# EAGLE design buzzer_single_layer (EAGLE 9.5.1)
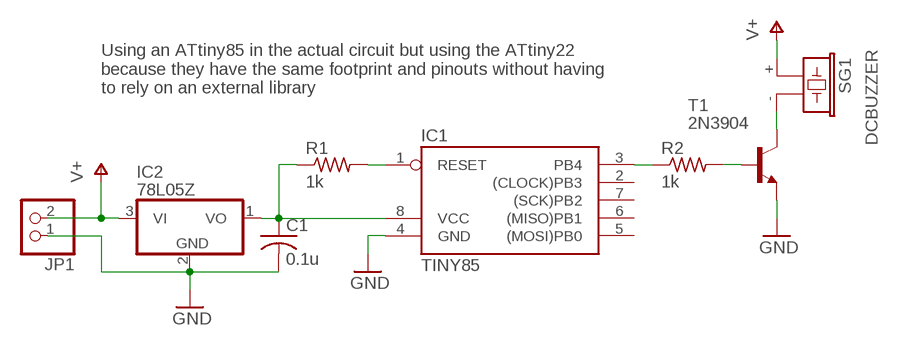
[diagram p0: schematic, sheet 1]

## Parts
C1  0.1u  C-US025-050X050  [C025-050X050]
IC1  TINY85  TINY22P  [DIL08]
IC2  78L05Z  [TO92]
JP1  PINHD-1X2  [1X02]
R1  1k  R-US_0204/7  [0204/7]
R2  1k  R-US_0204/7  [0204/7]
SG1  DCBUZZER  F/CM12P  [F/CM12P]
T1  2N3904  [TO92]

## Nets
5V: C1.1 IC1.8(VCC) IC2.1(VO) R1.1
BUZ_NEG: SG1.- T1.1(C)
GND: C1.2 IC1.4(GND) IC2.2(GND) JP1.1 T1.3(E)
N$1: R2.2 T1.2(B)
N$2: IC1.3(PB4) R2.1
RESET: IC1.1(RESET) R1.2
V+: IC2.3(VI) JP1.2 SG1.+
Unconnected: IC1.2((CLOCK)PB3) IC1.5((MOSI)PB0) IC1.6((MISO)PB1) IC1.7((SCK)PB2)

## Notes on the sheet
- Using an ATtiny85 in the actual circuit but using the ATtiny22 
  because they have the same footprint and pinouts without having
  to rely on an external library

## Library data of the parts
C1 = rcl:C-US: CAPACITOR, American symbol; SPICEPREFIX: C
IC1 = atmel:TINY22: MICROCONTROLLER 1K ROM 128 bytes RAM 128 bytes EEPROM; OC_FARNELL: unknown; OC_NEWARK: unknown
IC2 = linear:78*: Positive VOLTAGE REGULATOR Source: http://cache.national.com/ds/LM/LM78L05.pdf http://www.fairchildsemi.com/ds/LM/LM7805.pdf
JP1 = pinhead:PINHD-1X2: PIN HEADER
R1 R2 = rcl:R-US_: RESISTOR, American symbol; SPICEPREFIX: R
SG1 = buzzer:F/CM12P: BUZZER Source: Buerklin; OC_FARNELL: unknown; OC_NEWARK: unknown
T1 = transistor:2N3904: NPN TRANSISTOR

## Net classes
0 default: width 0.305 mm, drill 0.762 mm, clearance 0.61 mm

## Board
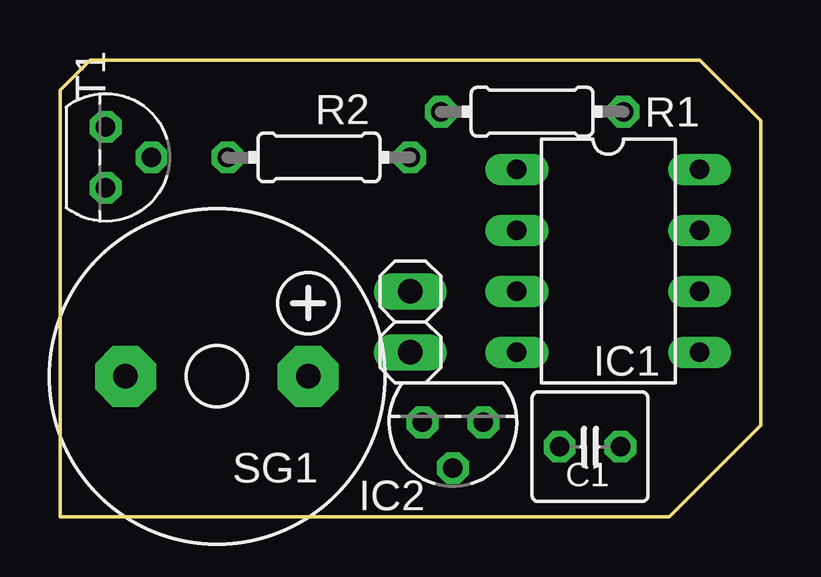
[diagram p1: board, top side]
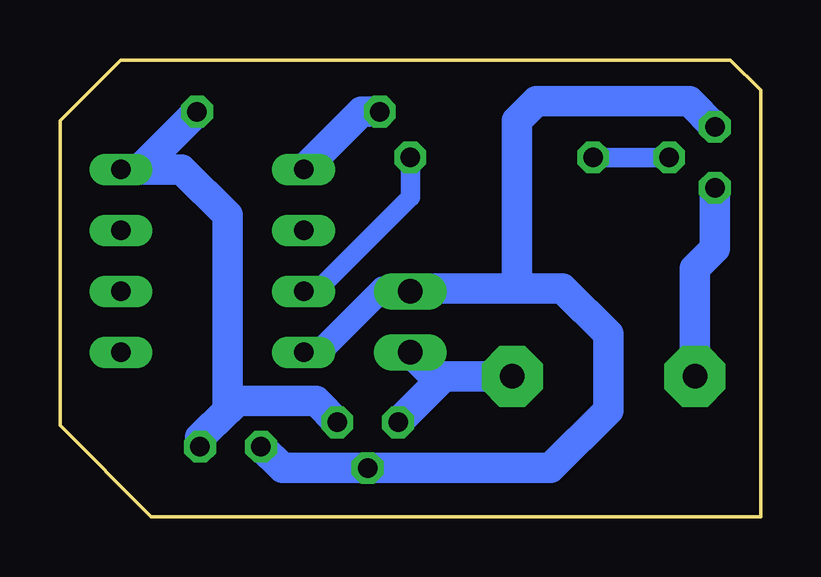
[diagram p2: board, bottom side, seen from below]

Size 29.21 x 19.05 mm. Coordinates in mm from the lower left corner, seen from the top.
Outline: 0,0 25.4,0 29.21,3.81 29.21,16.51 26.67,19.05 1.27,19.05 0,17.78 0,0
Copper layers (1*16): Top 0.035mm / dielectric 1.5mm / Bottom 0.035mm
Design rules "default": minimum track width 6mil, minimum drill 0.35mm, track to track 6mil, track to pad 6mil, pad to pad 6mil, via to via 6mil, smd to smd 6mil, copper to edge 40mil, drill to drill 6mil, minimum pad ring 10mil, minimum via ring 8mil, stop-mask expansion 4mil, vias tented up to drill 0mil, thermal gap 10mil

### Footprints (pad centres in the part's own frame; a part is rotated, then mirrored left to right if it is on the bottom)
C025-050X050 = drill 0.813 octagon: 1 -1.27,0; 2 1.27,0
DIL08 = drill 0.813 long: 1 -3.81,-3.81; 2 -1.27,-3.81; 3 1.27,-3.81; 4 3.81,-3.81; 5 3.81,3.81; 6 1.27,3.81; 7 -1.27,3.81; 8 -3.81,3.81
TO92 = drill 0.813 octagon: 1 -1.27,0; 2 0,1.905; 3 1.27,0
1X02 = drill 1.016 long: 1 -1.27,0; 2 1.27,0
0204/7 = drill 0.813 octagon: 1 -3.81,0; 2 3.81,0
F/CM12P = drill 1.016 pad 2.54 octagon: + 3.81,0; - -3.81,0
TO92' = drill 0.813 octagon: 1 1.27,0; 2 0,1.905; 3 -1.27,0

### Placement (x,y rotation side)
C1  22.1,2.92 180 top
IC1  22.86,10.67 270 top
IC2  16.38,3.94 180 top
JP1  14.61,8.13 270 top
R1  19.68,16.89 180 top
R2  10.79,14.99 180 top
SG1  6.54,5.86 0 top
T1  2N3904  [TO92']  1.91,14.99 270 top

### Tracks (layer width: path | path; a pad name or v marks a point on that pad's centre or on a via)
5V
  Bottom 1.27: R1.1 25.91,14.48 IC1.8 24.13,14.48 22.23,12.57 22.23,4.45 | IC2.1 18.54,4.83 21.84,4.83 22.23,4.45 | 22.23,4.45 23.37,3.3 C1.1
BUZ_NEG
  Bottom 1.27: T1.1 1.91,11.18 2.73,10.35 SG1.-
GND
  Bottom 1.016: IC1.4 18.41,6.86 15.75,9.53 14.48,9.53
  Bottom 1.27: 10.16,9.53 8.26,9.53 6.35,7.62 6.35,4.45 8.76,2.03 IC2.2 19.94,2.03 C1.2 | 10.16,9.53 14.48,9.53 JP1.1 | T1.3 2.97,17.32 9.35,17.32 10.16,16.51 10.16,9.53
N$1
  Bottom 0.813: T1.2 R2.2
N$2
  Bottom 0.813: R2.1 14.61,13.34 18.54,9.4 IC1.3
RESET
  Bottom 1.27: R1.2 16.64,16.89 IC1.1
V+
  Bottom 1.27: SG1.+ 13.19,5.86 | 13.19,5.86 IC2.3 | JP1.2 13.6,5.86 13.19,5.86